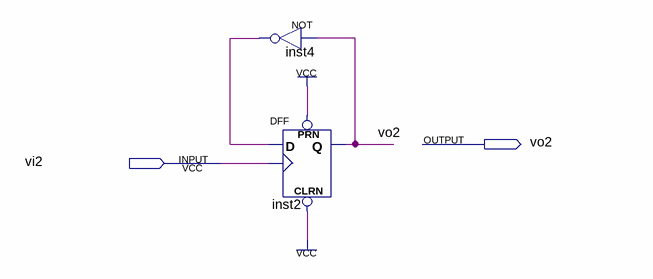
[diagram p0: schematic sheet]
// Quartus schematic 2f.bdf as structural Verilog: 2 symbols, 2 pins
module \2f  (
  input  vi2,
  output vo2
);

  wire inst4_out;

  not inst4 (inst4_out, vo2);
  DFF inst2 (.CLRN(1'b1), .CLK(vi2), .D(inst4_out), .PRN(1'b1), .Q(vo2));
endmodule
